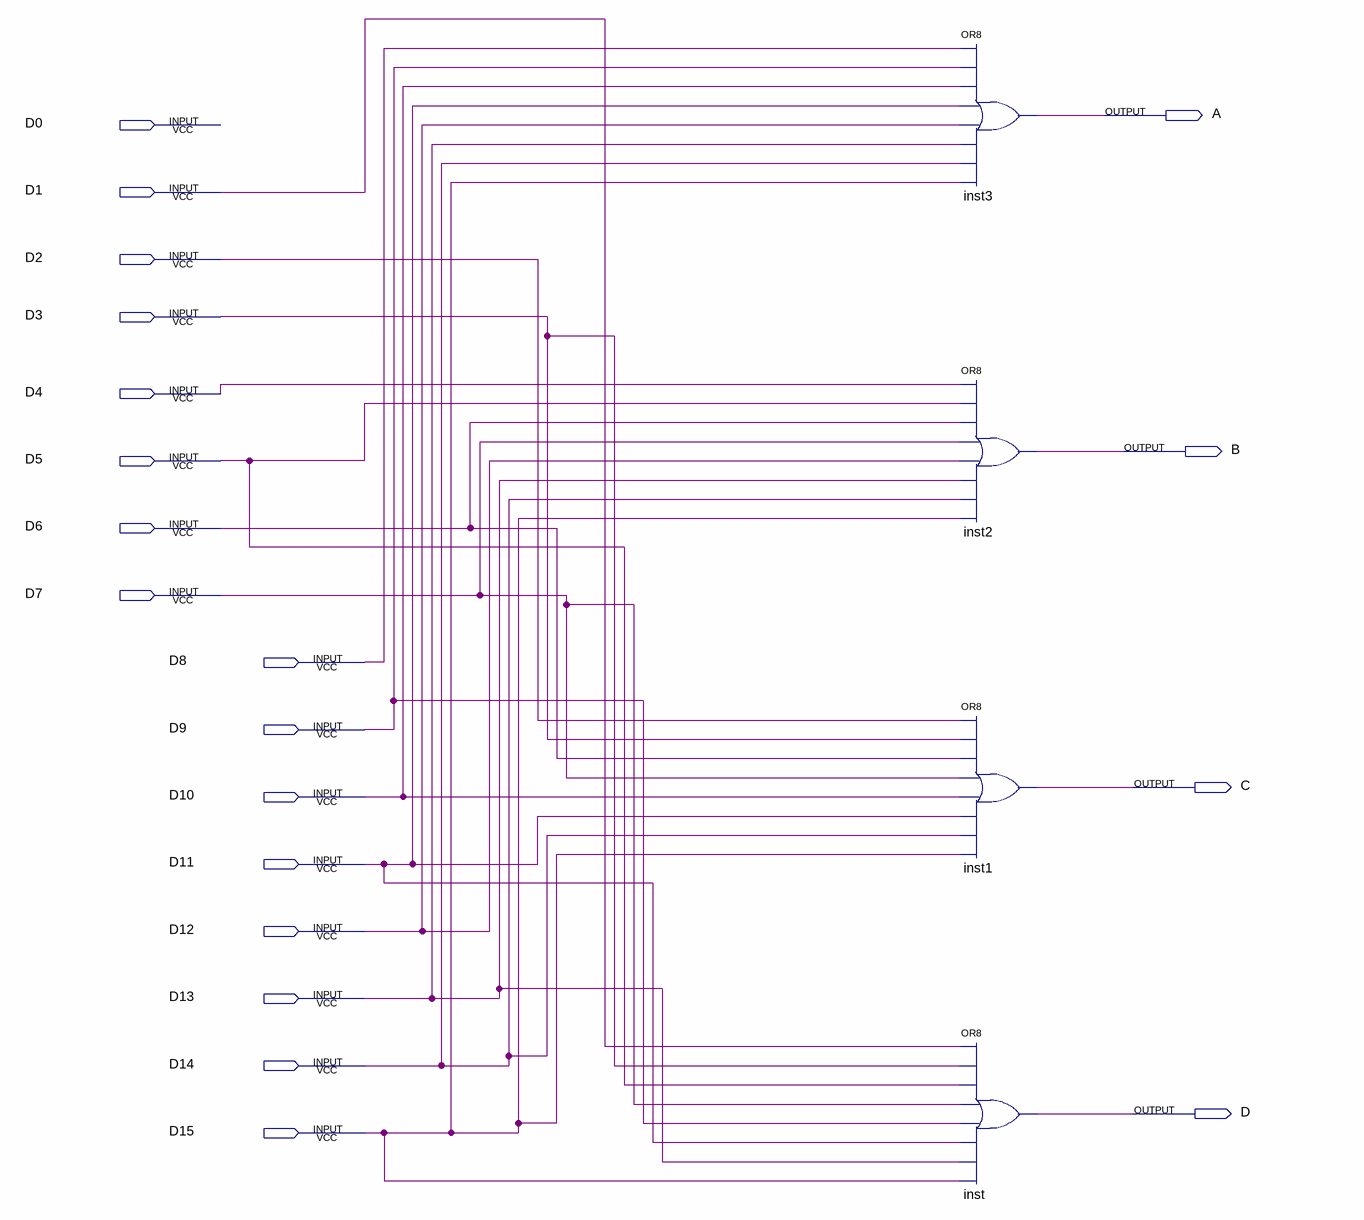
[diagram p0: schematic sheet]
// Quartus schematic CODEDIECISEISACUATRO.bdf as structural Verilog: 4 symbols, 20 pins
module CODEDIECISEISACUATRO (
  input  D0,
  input  D1,
  input  D2,
  input  D3,
  input  D4,
  input  D5,
  input  D6,
  input  D7,
  input  D8,
  input  D9,
  input  D10,
  input  D11,
  input  D12,
  input  D13,
  input  D14,
  input  D15,
  output A,
  output B,
  output C,
  output D
);

  or inst3 (A, D8, D9, D10, D11, D12, D13, D14, D15);
  or inst2 (B, D4, D5, D6, D7, D12, D13, D14, D15);
  or inst1 (C, D2, D3, D6, D7, D10, D11, D14, D15);
  or inst (D, D1, D3, D5, D7, D9, D11, D13, D15);
endmodule
